# Altium schematic sheet Comparator-Sampler.SchDoc
size A4; ApprovedBy: Mateusz Kowalik; CheckedBy: Mateusz Kowalik; Author: Mateusz Kowalik; CompanyName: InMotion Labs sp. z o.o.; DrawnBy: Mateusz Kowalik; Engineer: Mateusz Kowalik; Organization: InMotion Labs sp. z o.o.; Address1: Rydlówka 5A; Address2: 30-363 Kraków; Address4: Poland; DocumentNumber: 2; Revision: Rev 0; SheetNumber: 2; SheetTotal: 17
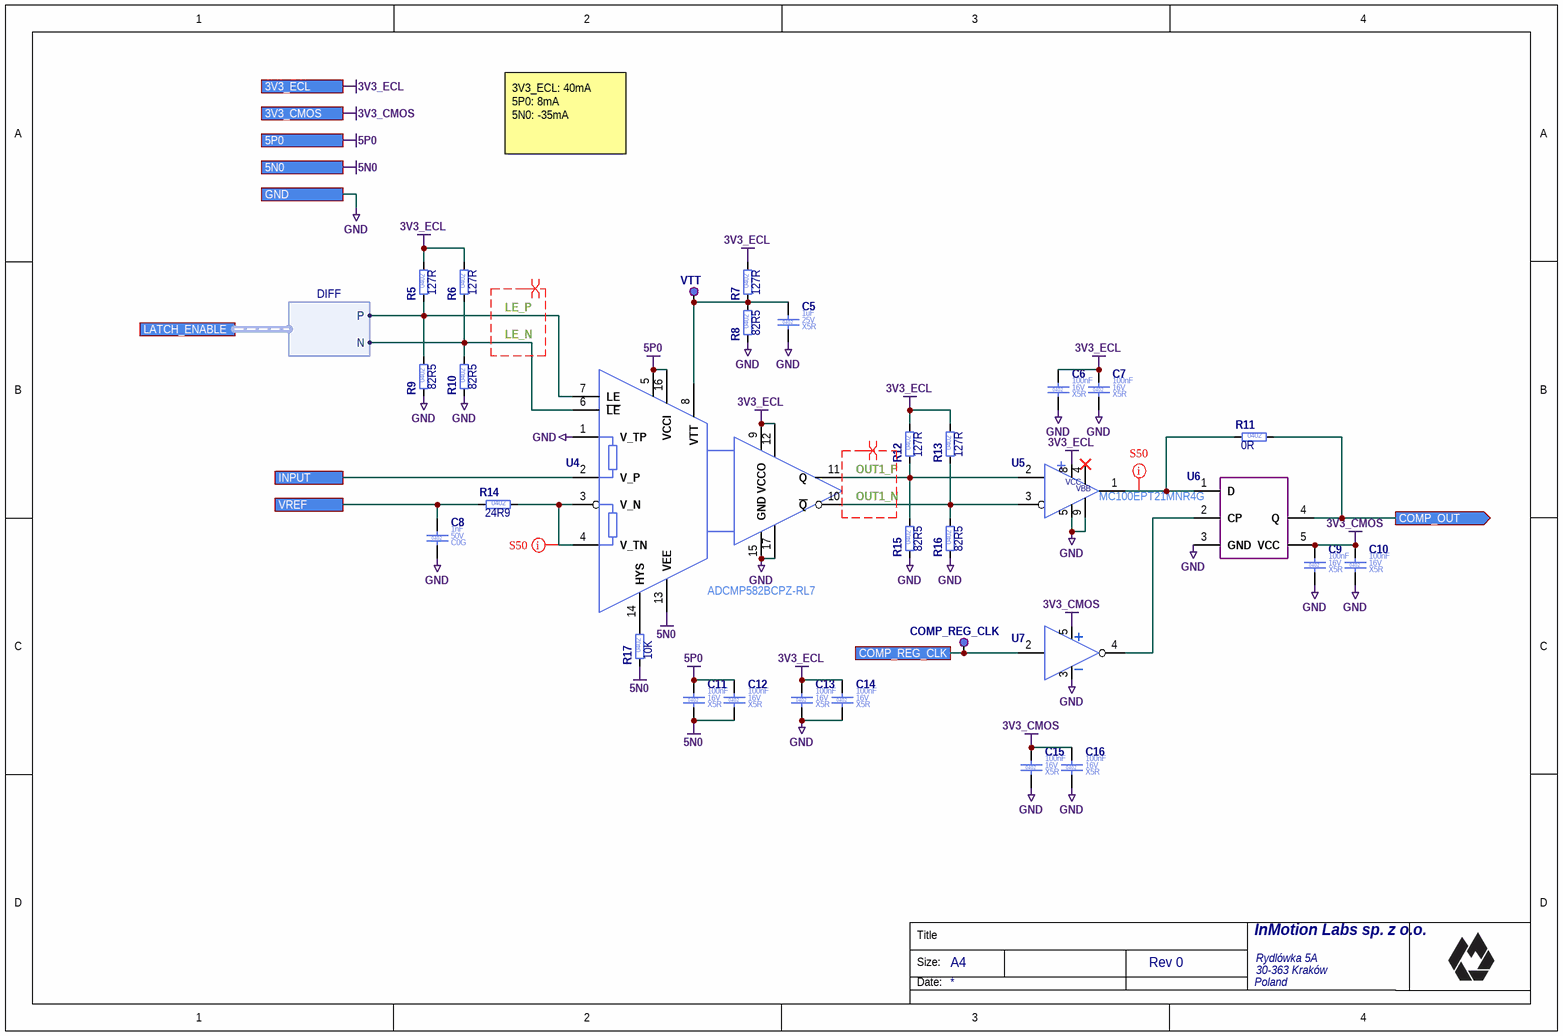
[diagram p0: Comparator-Sampler.SchDoc]

## Parts
C5  Case/Package: 0402  Voltage Rating (DC): 25V  Dielectric: X5R  Capacitance: 1uF  [C_0402_1005]  (hidden comment: C_1UF_25V_X5R_0402_10)
C6  Case/Package: 0402  Voltage Rating (DC): 16V  Dielectric: X5R  Capacitance: 100nF  [C_0402_1005]  (hidden comment: C_100NF_16V_X5R_0402_10)
C7  Case/Package: 0402  Voltage Rating (DC): 16V  Dielectric: X5R  Capacitance: 100nF  [C_0402_1005]  (hidden comment: C_100NF_16V_X5R_0402_10)
C8  Case/Package: 0402  Voltage Rating (DC): 50V  Dielectric: C0G  Capacitance: 1nF  [C_0402_1005]  (hidden comment: C_1NF_50V_C0G_0402_5)
C9  Case/Package: 0402  Voltage Rating (DC): 16V  Dielectric: X5R  Capacitance: 100nF  [C_0402_1005]  (hidden comment: C_100NF_16V_X5R_0402_10)
C10  Case/Package: 0402  Voltage Rating (DC): 16V  Dielectric: X5R  Capacitance: 100nF  [C_0402_1005]  (hidden comment: C_100NF_16V_X5R_0402_10)
C11  Case/Package: 0402  Voltage Rating (DC): 16V  Dielectric: X5R  Capacitance: 100nF  [C_0402_1005]  (hidden comment: C_100NF_16V_X5R_0402_10)
C12  Case/Package: 0402  Voltage Rating (DC): 16V  Dielectric: X5R  Capacitance: 100nF  [C_0402_1005]  (hidden comment: C_100NF_16V_X5R_0402_10)
C13  Case/Package: 0402  Voltage Rating (DC): 16V  Dielectric: X5R  Capacitance: 100nF  [C_0402_1005]  (hidden comment: C_100NF_16V_X5R_0402_10)
C14  Case/Package: 0402  Voltage Rating (DC): 16V  Dielectric: X5R  Capacitance: 100nF  [C_0402_1005]  (hidden comment: C_100NF_16V_X5R_0402_10)
C15  Case/Package: 0402  Voltage Rating (DC): 16V  Dielectric: X5R  Capacitance: 100nF  [C_0402_1005]  (hidden comment: C_100NF_16V_X5R_0402_10)
C16  Case/Package: 0402  Voltage Rating (DC): 16V  Dielectric: X5R  Capacitance: 100nF  [C_0402_1005]  (hidden comment: C_100NF_16V_X5R_0402_10)
COMP_REG_CLK  TP_PAD_1.3MM  [TP_PAD_1.3MM]  (value not drawn)  (no BOM)
R5  Resistance: 127R  Case/Package: 0402  [R_0402_1005]  (hidden comment: R_127R_0402_1)
R6  Resistance: 127R  Case/Package: 0402  [R_0402_1005]  (hidden comment: R_127R_0402_1)
R7  Resistance: 127R  Case/Package: 0402  [R_0402_1005]  (hidden comment: R_127R_0402_1)
R8  Resistance: 82R5  Case/Package: 0402  [R_0402_1005]  (hidden comment: R_82R5_0402_1)
R9  Resistance: 82R5  Case/Package: 0402  [R_0402_1005]  (hidden comment: R_82R5_0402_1)
R10  Resistance: 82R5  Case/Package: 0402  [R_0402_1005]  (hidden comment: R_82R5_0402_1)
R11  Resistance: 0R  Case/Package: 0402  [R_0402_1005]  (hidden comment: R_0R_0402_1)
R12  Resistance: 127R  Case/Package: 0402  [R_0402_1005]  (hidden comment: R_127R_0402_1)
R13  Resistance: 127R  Case/Package: 0402  [R_0402_1005]  (hidden comment: R_127R_0402_1)
R14  Resistance: 24R9  Case/Package: 0402  [R_0402_1005]  (hidden comment: R_24R9_0402_1)
R15  Resistance: 82R5  Case/Package: 0402  [R_0402_1005]  (hidden comment: R_82R5_0402_1)
R16  Resistance: 82R5  Case/Package: 0402  [R_0402_1005]  (hidden comment: R_82R5_0402_1)
R17  Resistance: 10K  Case/Package: 0402  [R_0402_1005]  (hidden comment: R_10K_0402_1)
U4  ADCMP582BCPZ-RL7  [QFN50P300X300X100_HS-17N]
U5  MC100EPT21MNR4G  [SON50P200X80_HS-9N]
U6  74LVC1G79GV,125  [SOT23-5_SC74A_SOT753_M]  (value not drawn)
U7  SN74AHC1G04DBVR  [SOT23-5_SC74A_SOT753_M]  (value not drawn)
VTT  TP_PAD_1.3MM  [TP_PAD_1.3MM]  (value not drawn)  (no BOM)

## Ports
3V3_CMOS, 3V3_ECL, 5N0, 5P0, COMP_OUT (out), COMP_REG_CLK, GND, INPUT, LATCH_ENABLE (harness DIFF), VREF

## Harnesses
DIFF: P, N

## Nets
3V3_CMOS: C9.1 C10.1 C15.1 C16.1 U6.5(VCC) U7.5(VCC) ; port 3V3_CMOS
3V3_ECL: C6.1 C7.1 C13.1 C14.1 R5.2 R6.2 R7.2 R12.2 R13.2 U4.9(VCCO) U4.12(VCCO) U5.8(VDD) ; port 3V3_ECL
5N0: C11.2 C12.2 R17.1 U4.13(VEE) ; port 5N0
5P0: C11.1 C12.1 U4.5(VCCI) U4.16(VCCI) ; port 5P0
GND: C5.2 C6.2 C7.2 C8.2 C9.2 C10.2 C13.2 C14.2 C15.2 C16.2 R8.1 R9.1 R10.1 R15.1 R16.1 U4.1(V_TP) U4.15(GND) U4.17(GND) U5.5(VSS) U5.9(VSS) U6.3(GND) U7.3(GND) ; port GND
COMP_OUT: R11.2 U6.4(Q) ; port COMP_OUT
COMP_REG_CLK: COMP_REG_CLK.1(TP) U7.2 ; port COMP_REG_CLK
INPUT: U4.2(V_P) ; port INPUT
LE_N: R6.1 R10.2 U4.6(~{LE}) ; port LATCH_ENABLE.N
LE_P: R5.1 R9.2 U4.7(LE) ; port LATCH_ENABLE.P
OUT1_N: R13.1 R16.2 U4.10(~{Q}) U5.3(~{D})
OUT1_P: R12.1 R15.2 U4.11(Q) U5.2(D)
VREF: C8.1 R14.1 ; port VREF
NetC5_1: C5.1 R7.1 R8.2 U4.8(VTT) VTT.1(TP)
NetR11_1: R11.1 U5.1(OUTA) U6.1(D)
NetR14_2: R14.2 U4.3(V_N) U4.4(V_TN)
NetR17_2: R17.2 U4.14(HYS)
NetU6_2: U6.2(CP) U7.4(OutY)

Not connected (* = marked no-connect by the designer): U5 4(VDD)*; U7 1(NC)

## Layout directives
net class S50: NetR11_1, NetR14_2
differential pair; differential pair class D100; net class D100: LE_N, LE_P, OUT1_N, OUT1_P

## Notes on the sheet
- 3V3_ECL: 40mA
  5P0: 8mA
  5N0: -35mA
- Title
- Size:
- Date:
- A4
- (in symbol MC100EPT21MNR4G) VCC; VBB

## Library data of the parts
C5 = C_1UF_25V_X5R_0402_10: Ceramic Capacitor; Manufacturer Part Number: CL05A105KA5NQNC; Manufacturer: Samsung Electro-Mechanics; Value: 1uF; Tolerance: 10%; Part Number: C_1UF_25V_X5R_0402_10; Mount: Surface Mount; Height: 550um; HelpURL: https://pl.mouser.com/datasheet/2/585/MLCC-1837944.pdf; RoHS: Compliant; Max Operating Temperature: 85°C; Status: MK; Supplier 1: Mouser; Supplier Part Number 1: 187-CL05A105KA5NQNC; Manufacturer 2: Samsung Electro-Mechanics; Manufacturer Part Number 2: CL05A105KA5NQNC; Supplier 2: LCSC; Supplier Part Number 2: C52923
C6 C7 C9-C16 = C_100NF_16V_X5R_0402_10: Ceramic Capacitor; Manufacturer Part Number: EMK105BJ104KV-F; Manufacturer: Taiyo Yuden; Value: 100nF; Tolerance: 10%; Part Number: C_100NF_16V_X5R_0402_10; Mount: Surface Mount; Height: 500um; HelpURL: http://datasheet.octopart.com/EMK105BJ104KV-F-Taiyo-Yuden-datasheet-8857305.pdf; RoHS: Compliant; Max Operating Temperature: 125°C; Status: MK; Supplier 1: Mouser; Supplier Part Number 1: 963-EMK105BJ104KV-F; Manufacturer 2: Samsung Electro-Mechanics; Manufacturer Part Number 2: CL05B104KO5NNNC; Supplier 2: LCSC; Supplier Part Number 2: C1525
C8 = C_1NF_50V_C0G_0402_5: Ceramic Capacitor; Manufacturer Part Number: UMK105CG102JV-F; Manufacturer: Taiyo Yuden; Value: 1nF; Tolerance: 5%; Part Number: C_1NF_50V_C0G_0402_5; Mount: Surface Mount; Height: 500um; HelpURL: https://pl.mouser.com/datasheet/2/396/mlcc02_e-1307760.pdf; RoHS: Compliant; Max Operating Temperature: 125°C; Status: AK; Supplier 1: Mouser; Supplier Part Number 1: 963-JMK212ABJ106KG-T; Manufacturer 2: Guangdong Fenghua Advanced Tech; Manufacturer Part Number 2: 0402B102K500NT; Supplier 2: LCSC; Supplier Part Number 2: C1523
COMP_REG_CLK VTT = TP_PAD_1.3MM: Testpoint SMD 1.3mm; Part Number: TP_PAD_1.3MM; Case/Package: SMD; Length: 0mm
R5-R7 R12 R13 = R_127R_0402_1: Thick Film Resistor; Manufacturer: Yageo; Manufacturer Part Number: RC0402FR-07127RL; Value: 127R; Tolerance: 1%; Voltage Rating (DC): 50V; Power Rating: 63mW; Stats: MK; Part Number: R_127R_0402_1; Mount: Surface Mount; Height: 350um; HelpURL: https://pl.mouser.com/datasheet/2/447/PYu_RC_Group_51_RoHS_L_10-1664068.pdf; RoHS: Compliant; Max Operating Temperature: 155°C; Supplier 1: Mouser; Supplier Part Number 1: 603-RC0402FR-07127RL; Manufacturer 2: Uniroyal Elec; Manufacturer Part Number 2: 0402WGF1270TCE; Supplier 2: LCSC; Supplier Part Number 2: C247127
R8-R10 R15 R16 = R_82R5_0402_1: Thick Film Resistor; Manufacturer: Yageo; Manufacturer Part Number: RC0402FR-0782R5L; Value: 82R5; Tolerance: 1%; Voltage Rating (DC): 50V; Power Rating: 63mW; Stats: MK; Part Number: R_82R5_0402_1; Mount: Surface Mount; Height: 350um; HelpURL: https://pl.mouser.com/datasheet/2/447/PYu-RC_Group_51_RoHS_L_10-1527934.pdf; RoHS: Compliant; Max Operating Temperature: 155°C; Supplier 1: Mouser; Supplier Part Number 1: 603-RC0402FR-0782R5L; Manufacturer 2: Uniroyal Elec; Manufacturer Part Number 2: 0402WGF825JTCE; Supplier 2: LCSC; Supplier Part Number 2: C52037
R11 = R_0R_0402_1: Thick Film Resistor; Manufacturer: Yageo; Manufacturer Part Number: RC0402FR-070RL; Value: 0R; Tolerance: 1%; Voltage Rating (DC): 50V; Power Rating: 63mW; Stats: MK; Part Number: R_0R_0402_1; Mount: Surface Mount; Height: 350um; HelpURL: http://datasheet.octopart.com/2176049-1-TE-Connectivity---AMP-datasheet-11120217.pdf; RoHS: Compliant; Max Operating Temperature: 155°C; Supplier 1: Mouser; Supplier Part Number 1: 603-RC0402FR-070RL; Manufacturer 2: Uniroyal Elec; Manufacturer Part Number 2: 0402WGF0000TCE; Supplier 2: LCSC; Supplier Part Number 2: C17168
R14 = R_24R9_0402_1: Thick Film Resistor; Manufacturer: Yageo; Manufacturer Part Number: RC0402FR-0724R9L; Value: 24R9; Tolerance: 1%; Voltage Rating (DC): 50V; Power Rating: 63mW; Stats: MK; Part Number: R_24R9_0402_1; Mount: Surface Mount; Height: 350um; HelpURL: http://datasheet.octopart.com/RC0402FR-07825KL-Yageo-datasheet-127823281.pdf; RoHS: Compliant; Max Operating Temperature: 155°C; Supplier 1: Mouser; Supplier Part Number 1: 603-RC0402FR-0724R9L; Manufacturer 2: Uniroyal Elec; Manufacturer Part Number 2: 0402WGF249JTCE; Supplier 2: LCSC; Supplier Part Number 2: C5099
R17 = R_10K_0402_1: Thick Film Resistor; Manufacturer: Yageo; Manufacturer Part Number: RC0402FR-7W10KL; Value: 10K; Tolerance: 1%; Voltage Rating (DC): 50V; Power Rating: 63mW; Stats: MK; Part Number: R_10K_0402_1; Mount: Surface Mount; Height: 350um; HelpURL: https://pl.mouser.com/datasheet/2/447/PYu-RC_Group_51_RoHS_L_10-1664068.pdf; RoHS: Compliant; Max Operating Temperature: 155°C; Supplier 1: Mouser; Supplier Part Number 1: 603-RC0402FR-7W10KL; Manufacturer 2: Uniroyal Elec; Manufacturer Part Number 2: 0402WGF1002TCE; Supplier 2: LCSC; Supplier Part Number 2: C25744
U4 = ADCMP582BCPZ-RL7: Single Comparator; Manufacturer: Analog Devices; Number of Comparators: 1; Response Time: 180ps; Input Offset Voltage: 4mV; Marking: G10; Max Supply Voltage: 5.5V; Min Supply Voltage: 4.5V; Part Number: ADCMP582BCPZ-RL7; Manufacturer Part Number: ADCMP582BCPZ-RL7; Case/Package: QFN14; Mount: Surface Mount; Height: 0.8mm; Max Operating Temperature: 125; HelpURL: https://www.analog.com/media/en/technical-documentation/data-sheets/ADCMP580_581_582.pdf; Number of Pins: 16; RoHS: Compliant
U5 = MC100EPT21MNR4G: Differential LVPECL/LVDS/CML to LVTTL/LVCMOS Translator; Manufacturer: ON Semiconductor; Output Current: 24mA; Marking: 3RM; Max Supply Voltage: 3.8V; Min Supply Voltage: 3.3V; Part Number: MC100EPT21MNR4G; Case/Package: DFN-8; Max Output Current: 24mA; Mount: Surface Mount; Height: 1mm; HelpURL: https://datasheet.octopart.com/MC100EPT21MNR4G-ON-Semiconductor-datasheet-12520234.pdf; Max Operating Temperature: 85°C; RoHS: Compliant; Status: MK; Manufacturer Part Number: MC100EPT21MNR4G; Supplier 1: Mouser; Supplier Part Number 1: 863-MC100EPT21MNR4G
U6 = 74LVC1G79GV,125: D Flip Flop Positive Edge Trigger; Manufacturer: Nexperia; Output Current: 32mA; Marking: V79; Max Supply Voltage: 5.5V; Min Supply Voltage: 1.65V; Part Number: 74LVC1G79GV,125; Case/Package: SOT-573; Max Output Current: 32mA; Mount: Surface Mount; Height: 1.1mm; HelpURL: https://datasheet.octopart.com/74LVC1G79GV%2C125-Nexperia-datasheet-87580644.pdf; Max Operating Temperature: 125°C; RoHS: Compliant; Status: MK; Manufacturer Part Number: 74LVC1G79GV,125; Supplier 1: Mouser; Supplier Part Number 1: 771-LVC1G79GV125
U7 = SN74AHC1G04DBVR: Inverters Single; Manufacturer: Texas Instruments; Output Current: 25mA; Max Output Current: 50mA; Max Supply Voltage: 5.5V; Min Supply Voltage: 2V; Part Number: SN74AHC1G04DBVR; Case/Package: SOT-23; Mount: Surface Mount; Height: 1.1mm; HelpURL: http://www.ti.com/lit/ds/symlink/sn74ahc1g04.pdf; Max Operating Temperature: 125°C; RoHS: Compliant; Status: AK; Manufacturer Part Number: SN74AHC1G04DBVR